# Altium schematic sheet USB.SchDoc
size A4; SheetNumber: 6; SheetTotal: 11
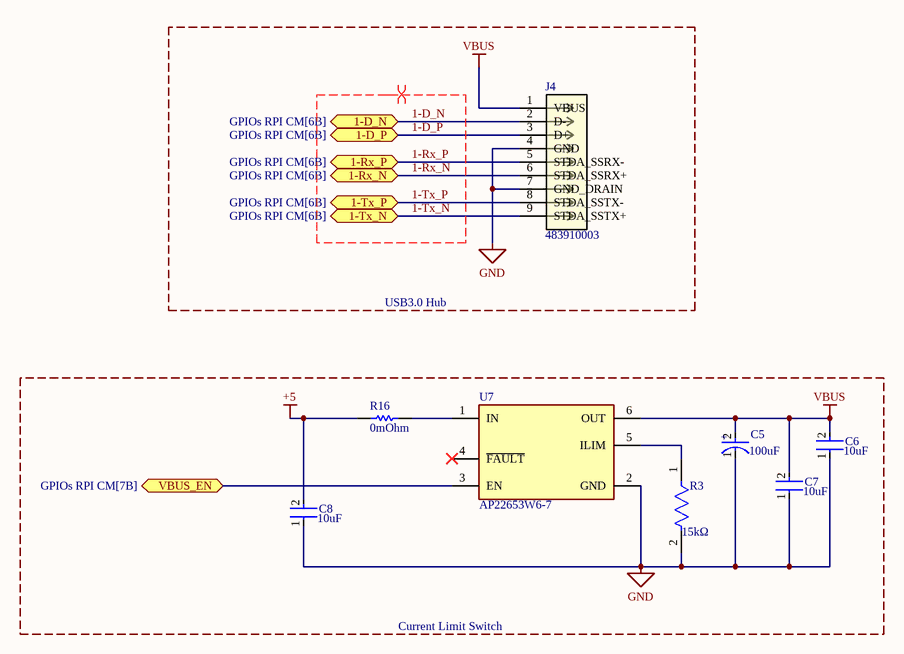
[diagram p0: USB.SchDoc]

## Parts
C5  Capacitance: 100uF  [FP-SC-MFG]  (hidden comment: EEE-1AA101WR)
C6  Capacitance: 10uF  [FP-C1608-080-0_1-MFG]  (hidden comment: C1608X5R1A106K080AC)
C7  Capacitance: 10uF  [FP-C1608-080-0_1-MFG]  (hidden comment: C1608X5R1A106K080AC)
C8  Capacitance: 10uF  [FP-C1608-080-0_1-MFG]  (hidden comment: C1608X5R1A106K080AC)
J4  483910003  [CONN_483910003_MOL]
R3  Resistance: 15kΩ  [FP-ERJ2R-MFG]  (hidden comment: ERJ-2RKF1502X)
R16  Resistance: 0mOhm  [RESC1005X40X25LL05T05]  (hidden comment: ERJ2GE0R00X)
U7  AP22653W6-7  [FP-SOT26-MFG]

## Blocks framed on the sheet
USB3.0 Hub: J4
Current Limit Switch: C5-C8 R3 R16 U7

## Ports
1-D_N (bidir, see GPIOs RPI CM[6B]), 1-D_P (bidir, see GPIOs RPI CM[6B]), 1-Rx_N (bidir, see GPIOs RPI CM[6B]), 1-Rx_P (bidir, see GPIOs RPI CM[6B]), 1-Tx_N (bidir, see GPIOs RPI CM[6B]), 1-Tx_P (bidir, see GPIOs RPI CM[6B]), VBUS_EN (bidir, see GPIOs RPI CM[7B])

## Nets
+5: C8.2 R16.2
GND: C5.1(C) C6.1 C7.1 C8.1 J4.4(GND) J4.7(GND_DRAIN) R3.2 U7.2(GND)
VBUS: C5.2(A) C6.2 C7.2 J4.1(VBUS) U7.6(OUT)
1-D_N: J4.2(D-) ; port 1-D_N
1-D_P: J4.3(D+) ; port 1-D_P
1-Rx_N: J4.6(STDA_SSRX+) ; port 1-Rx_N
1-Rx_P: J4.5(STDA_SSRX-) ; port 1-Rx_P
1-Tx_N: J4.9(STDA_SSTX+) ; port 1-Tx_N
1-Tx_P: J4.8(STDA_SSTX-) ; port 1-Tx_P
VBUS_EN: U7.3(EN) ; port VBUS_EN
NetR3_1: R3.1 U7.5(ILIM)
NetR16_1: R16.1 U7.1(IN)

Not connected (* = marked no-connect by the designer): U7 4(~{FAULT})*

## Layout directives
differential pair: 1-D_N, 1-D_P, 1-Rx_N, 1-Rx_P, 1-Tx_N, 1-Tx_P

## Notes on the sheet
- (in symbol CMP-05427-000047-1) +

## Library data of the parts
C5 = CMP-05427-000047-1: CAP ALUM 100UF 20% 10V SMD; Life (Hours): 1000Hour; Ripple Current: 50mA; Packaging: Tape and Reel; Diameter: 5mm; Voltage Rating (DC): 10V; Mount: Surface Mount; Max Operating Temperature: 85°C; Length: 5.5mm; Case/Package: Radial; Height: 5.4mm; Construction: Cylindrical; Termination: SMD/SMT; Height - Seated (Max): 0.213inch; Series: S; Min Operating Temperature: -40°C; Tolerance: 20%; Voltage Rating: 10V; Package Quantity: 1; Radiation Hardening: No; Ripple Current (AC): 50mA; Lead Free: Lead Free; RoHS Compliant: Yes; Contact Plating: Tin
C6-C8 = CMP-2000-04979-3: Multilayer Ceramic Capacitors 10μF ±10% 10V X5R SMD 0603; Dielectric Material: Ceramic; Construction: Flat; Height: 0.8mm; Thickness: 0.035inch; Case Code (Metric): 1608; Radiation Hardening: No; Number of Pins: 2; Voltage Rating (DC): 10V; Depth: 0.8mm; Voltage: 10V; RoHS Compliant: Yes; Voltage Rating: 10V; Package Quantity: 1; Resistor Type: Ceramic; Termination: SMD/SMT; Lead Free: Lead Free; REACH SVHC: No SVHC; Tolerance: 10%; Mount: Surface Mount; Series: C; Packaging: Tape and Reel; Width: 0.8mm; Dielectric: X5R; Weight: 7.1E-05oz; Length: 1.6mm; Max Operating Temperature: 85°C; Case Code (Imperial): 0603; Case/Package: 0603; Min Operating Temperature: -55°C
J4 = 483910003: No Description Available; Mfr_Name: Molex Connector Corporation; Type: USB, DVI, HDMI, Connectors; RefDes: RefDes
R3 = CMP-2002-00694-4: RES SMD 15K OHM 1% 1/10W 0402; Manufacturer: Panasonic; Automotive Grade: Grade 0; Voltage Rating: 50V; Temperature Coefficient: 100ppm/°C; Power Rating: 0.1W; Value: 15kΩ; ComponentLink2URL: https://industrial.panasonic.com/cdbs/www-data/pdf/RDA0000/AOA0000C304.pdf; Automotive: Yes; Temperature: -55°C to +155°C; Height: 0.4mm; Digikey Description: RES SMD 15K OHM 1% 1/10W 0402; Category: Res; Device Class L2: Resistors; Device Class L1: Passive Components; Package: ERJ2R; Temperature Range Low: -55°C; Tolerance: 1%; Series: ERJ; Manufacturer Part Number: ERJ-2RKF1502X; Footprint Url: https://b2b-api.panasonic.eu/file_stream/pids/fileversion/1180; Mouser Description: Res Thick Film 1.0 x 0.5 mm 15K Ohm 1% 0.1W(1/10W) 100ppm/ C Molded SMD Punched Carrier T/R; Composition: Thick Film; Lead Free: Yes; Device Class L3: Chip SMD Resistors; Octopart: https://octopart.com/erj-2rkf1502x-panasonic-55404985; RoHS: TRUE; Temperature Range High: +155°C; ComponentLink2Description: Datasheet
R16 = CMP-2000-07451-1: Chip Resistor, 0 Ohm, 0.1 W, -55 to 155 degC, 0402 (1005 Metric), RoHS, Tape and Reel; Manufacturer: Panasonic; Voltage Rating (DC): 50V; Temperature Coefficient: 600ppm/��C; Max Power Dissipation: 100mW; Tolerance: 5%; Number of Terminations: 2; Mount: SurfaceMount; Height: 0.35mm; Packaging: TapeandReel; Contact Plating: Tin; Manufacturer URL: http://www.panasonic.com/; Composition: ThickFilm; Max Operating Temperature: 155degC; REACH SVHC: NoSVHC; Case/Package: 0402; Package Reference: 402; Depth: 0.5mm; Package Description: 2-Pin Surface Mount Device, Body 1 x 0.5 mm; Datasheet URL: https://industrial.panasonic.com/cdbs/www-data/pdf/RDA0000/AOA0000C301.pdf; RoHSCompliant: True; Case Code (Imperial): 0402; Military Standard: Not; Min Operating Temperature: -55degC; Power Rating: 100mW; Datasheet Version: 03/2015; Length: 1mm; Case Code (Metric): 1005; Termination: SMD/SMT; Mounting Technology: SurfaceMount; Voltage Rating: 50V; Width: 0.02inch; Package Quantity: 1; Lead Free: LeadFree; Radiation Hardening: No
U7 = CMP-12749-000002-1: LOAD SWITCH,SOT26,T&R,3K